# Altium schematic sheet Divider.SchDoc: GEM AVD eFuse
size 420 x 297 mm; Author: G.Kasprowicz; CompanyName: WUT ISE; DrawnBy: G.Kasprowicz; Organization: WUT ISE; Address1: PW ISE; Address2: Nowowiejska 15/19 00-665 Warsaw; Address3: gkasprow@gmail.com; Revision: 2; SheetNumber: 6; SheetTotal: 6; ModifiedBy: -; CheckedDate: -; Title2: channel connectors; DivGrp: WUT ISE; Designer: G.Kasprowicz; ModifiedDate: -; ProjectName: Sensor Box
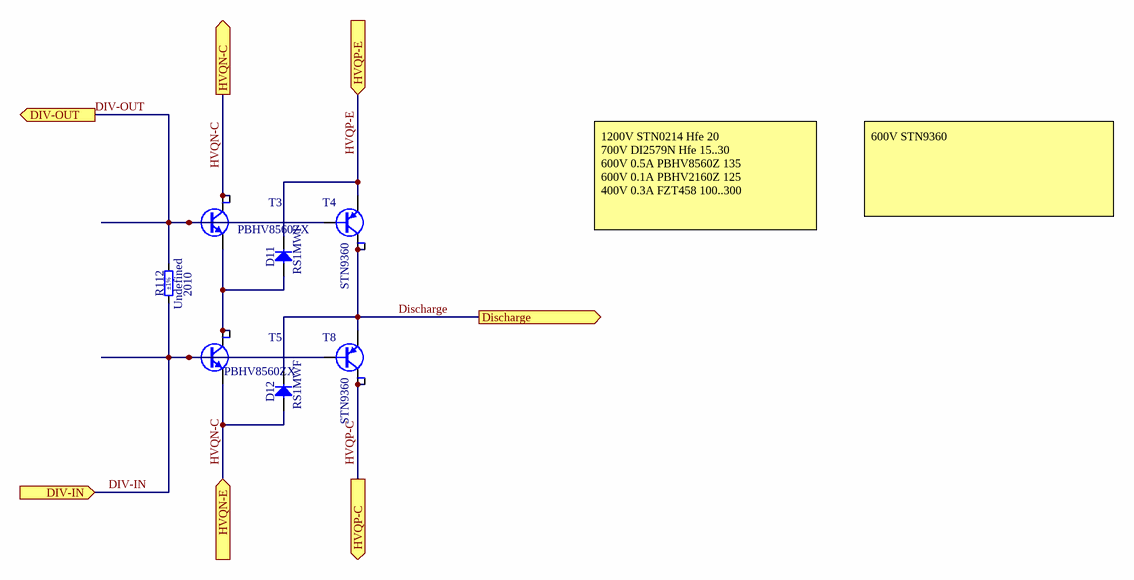
[diagram p0: Divider.SchDoc]

## Parts
D11  RS1MWF  [SOD-123F]
D12  RS1MWF  [SOD-123F]
R112  Undefined  Tolerance: ±1%  Case: 2010  [RES_VISHAY_CRHV2010A]
T3  PBHV8560ZX  [SOT230P700X180-4N]
T4  STN9360  [SOT230P700X180-4N]
T5  PBHV8560ZX  [SOT230P700X180-4N]
T8  STN9360  [SOT230P700X180-4N]

## Ports
Discharge (out, see GEM_AVD_eFuse[3E]), DIV-IN (in, see GEM_AVD_eFuse[3D]), DIV-OUT (out, see GEM_AVD_eFuse[3D]), HVQN-C (out, see GEM_AVD_eFuse[3E]), HVQN-E (in, see GEM_AVD_eFuse[3D]), HVQP-C (out, see GEM_AVD_eFuse[3D]), HVQP-E (in, see GEM_AVD_eFuse[3E])

## Nets
Discharge: D12.1(C) T4.2(C) T4.4(C) T8.3(E) ; port Discharge
DIV-IN: R112.1 T5.1(B) T8.1(B) ; port DIV-IN
DIV-OUT: R112.2 T3.1(B) T4.1(B) ; port DIV-OUT
HVQN-C: D12.2(A) T3.2(C) T3.4(C) T5.3(E) ; port HVQN-C, port HVQN-E
HVQP-C: T8.2(C) T8.4(C) ; port HVQP-C
HVQP-E: D11.1(C) T4.3(E) ; port HVQP-E
NetD11_2: D11.2(A) T3.3(E) T5.2(C) T5.4(C)

## Notes on the sheet
- 1200V STN0214 Hfe 20
  700V DI2579N Hfe 15..30
  600V 0.5A PBHV8560Z 135
  600V 0.1A PBHV2160Z 125
  400V 0.3A FZT458 100..300
- 600V STN9360
- Project/Equipment
- Document
- Designer
- Drawn by
- Check.by
- Copyright WUT ISE 2020.
  This documentation describes Open Hardware and is licensed under the CERN OHL v.1.2. You may redistribute and modify this documentation under the terms of the CERN OHL v.1.2. (http://ohwr.org/CERNOHL). This documentation is distributed WITHOUT ANY EXPRESS OR IMPLIED WARRANTY, INCLUDING OF MERCHANTABILITY, SATISFACTORY QUALITY AND FITNESS FOR A PARTICULAR PURPOSE. Please see the CERN OHL v.1.2 for applicable conditions.
- Contact
- File
- Last Mod.
- Print Date
- Sheet
- Size
- A3
- of
- Rev

## Library data of the parts
D11 D12 = RS1MWF: Diode; Part Description: High Voltage Fast Recover Rectifier; Manufacturer: DIODES INCORPORATED; Voltage: 1000V; Power: 1A; PressFit: No; Bonding: No; Part Number: RS1MWF; Component Kind: Standard; Component Type: Standard; Device: RS1MWF; PackageDescription: SODF (SOD-123F) Diode; 1.80mm W X 0.3.50mm L X 1.15mm H body, IPC Medium Density; Manufacturer Part Number: RS1MWF; Pin Count: 2; Case: SOD123F; Mounted: Yes; Socket: No; SMD: Yes; Sense: No; ComponentHeight: 1.15mm; HelpURL: \\cern.ch\dfs\Applications\Altium\Datasheets\RS1MWF.pdf; Author: CERN DEM HF; CreateDate: 29.02.2024; LatestRevisionDate: 29.02.2024
R112 = R2010_1G_1%_0.5W_100PPM_VISHAY_CRHV2010AF1G00FKET: Resistor - 1%; Manufacturer: VISHAY TECHNO; Power: 0.5W; TC: ±100ppm/°C; PressFit: No; Part Number: Undefined; Component Kind: Standard; Component Type: Standard; Pin Count: 2; Value: Undefined; Status: None; Part Description: Undefined; Manufacturer Part Number: Undefined; Mounted: Yes; Sense: No; Socket: No; SMD: Yes; ComponentHeight: 0.68mm; HelpURL: \\cern.ch\dfs\Applications\Altium\Datasheets\R2010_VISHAY_CRHV.pdf; Author: CERN DEM JLC; CreateDate: 03.06.2015; LatestRevisionDate: 03.06.2015
T3 T5 = Q_PBHV8560Z: 600 V, 0.5 A NPN high-voltage low VCEsat (BISS) transistor; Part Description: 600V 500mA NPN High Voltage Transistor; Manufacturer: Nexperia; PressFit: No; Bonding: No; Part Number: PBHV8560ZX; Component Kind: Standard; Component Type: Standard; Device: PBHV8560ZX; PackageDescription: SOT223, 2.30mm Pitch; 4 Pin, 3.70mm W X 6.70mm L X 1.80mm H body, IPC Medium Density; Manufacturer Part Number: PBHV8560ZX; Pin Count: 4; Case: SOT223; Mounted: Yes; Socket: No; SMD: Yes; Sense: No; ComponentHeight: 1.8mm; HelpURL: \\cern.ch\dfs\Applications\Altium\Datasheets\FZT458TA.pdf; Author: GK; CreateDate: 15.06.2011; LatestRevisionDate: 15.06.2011
T4 T8 = STN9360: PNP Transistor; Part Description: 250V 100mA PNP High-Voltage Transistors; Manufacturer: STMicroelectronics; PressFit: No; Bonding: No; Part Number: STN9360; Component Kind: Standard; Component Type: Standard; Device: STN9360; PackageDescription: SOT223, 2.30mm Pitch; 4 Pin, 3.70mm W X 6.70mm L X 1.80mm H body, IPC Medium Density; Manufacturer Part Number: STN9360; Pin Count: 4; Case: SOT223; Mounted: Yes; Socket: No; SMD: Yes; Sense: No; ComponentHeight: 1.8mm; HelpURL: \\cern.ch\dfs\Applications\Altium\Datasheets\BF723,115.pdf; Author: FS; CreateDate: 15.06.2011; LatestRevisionDate: 15.06.2011